# Altium schematic sheet USB-UART (FTDI FT230XS).SchDoc
size A4; Revision: 0; SheetNumber: 1
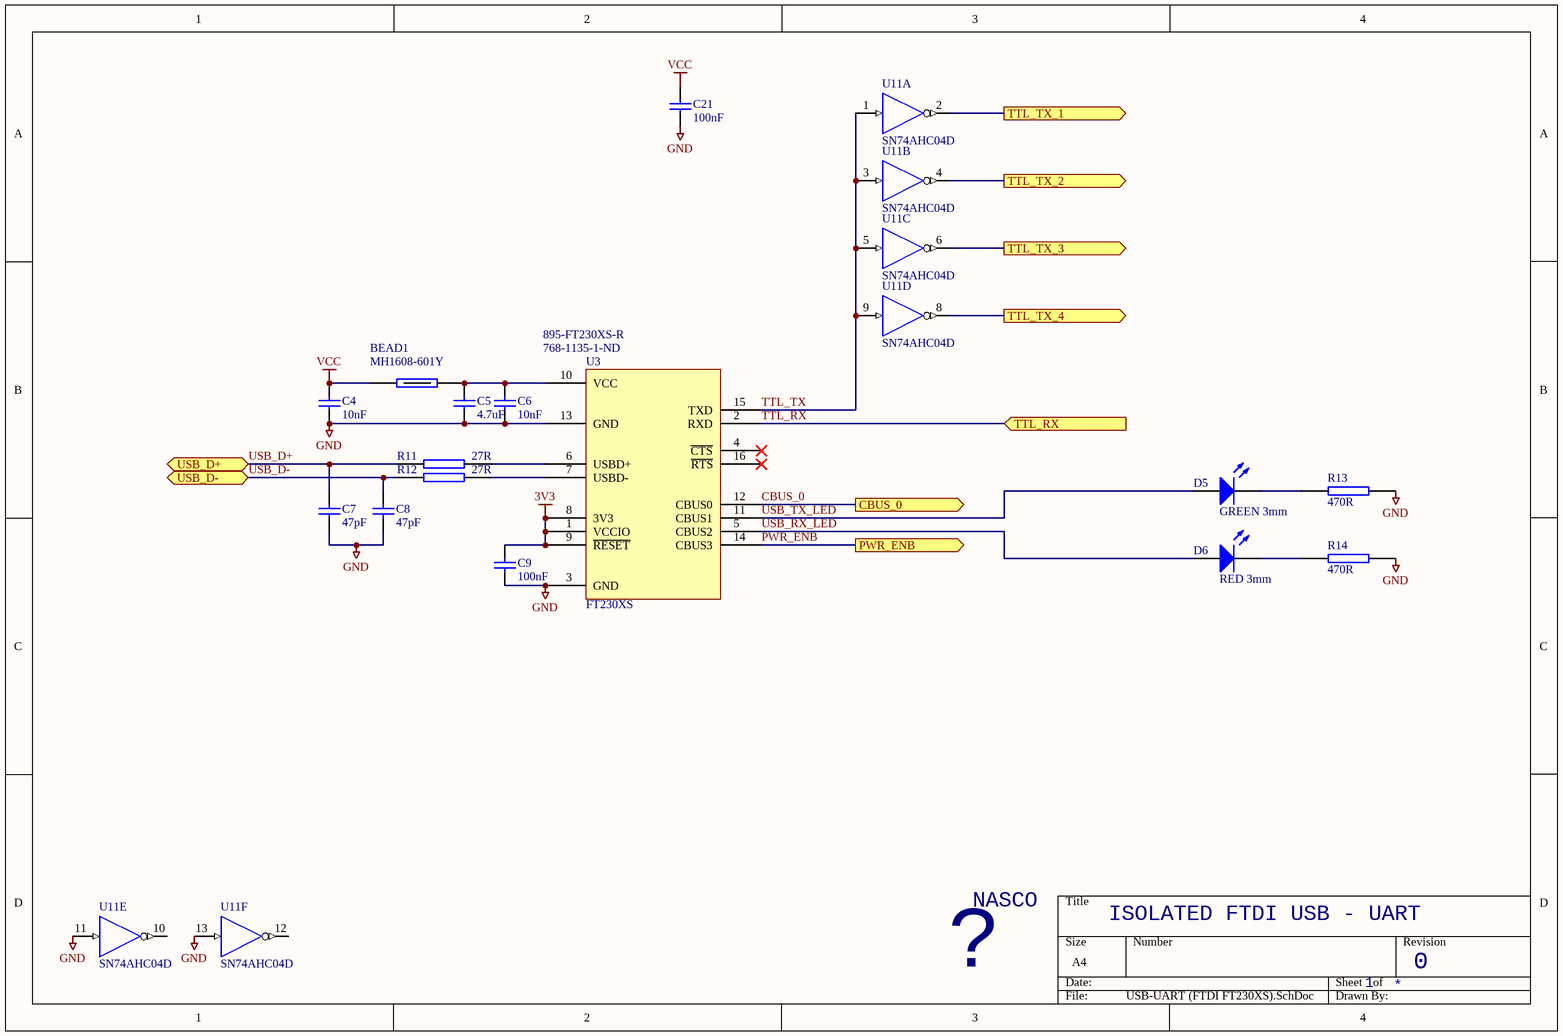
[diagram p0: USB-UART (FTDI FT230XS).SchDoc]

## Parts
BEAD1  MH1608-601Y  [RES (3D) - 0603]
C4  10nF  [CAP (3D) - 0603]
C5  4.7uF  [CAP ELECTRO SIZE-C]
C6  10nF  [CAP (3D) - 0603]
C7  47pF  [CAP (3D) - 0603]
C8  47pF  [CAP (3D) - 0603]
C9  100nF  [CAP (3D) - 0603]
C21  100nF  [CAP (3D) - 0603]
D5  GREEN 3mm  [LED(3D) 3MM RIGHT ANGLE GREEN]
D6  RED 3mm  [LED(3D) 3MM RIGHT ANGLE RED]
R11  27R  [RES (3D) - 0603]
R12  27R  [RES (3D) - 0603]
R13  470R  [RES (3D) - 0603]
R14  470R  [RES (3D) - 0603]
U3  FT230XS  Supplier Part Number 1: 768-1135-1-ND  Supplier Part Number 2: 895-FT230XS-R  [SSOP16_L]
U11  SN74AHC04D  [SOIC-14]  (parts A,B,C,D,E,F of 6)

## Ports
CBUS_0 (out), PWR_ENB (out), TTL_RX, TTL_TX_1 (out), TTL_TX_2 (out), TTL_TX_3 (out), TTL_TX_4 (out), USB_D+ (bidir), USB_D- (bidir)

## Nets
3V3: C9.2 U3.1(VCCIO) U3.8(3V3) U3.9(~{RESET})
GND: C4.1 C5.2 C6.1 C7.1 C8.1 C9.1 C21.1 R13.2 R14.2 U3.3(GND) U3.13(GND) U11.7(GND) U11.11(A) U11.13(A)
VCC: BEAD1.1 C4.2 C21.2 U11.14(VCC)
CBUS_0: U3.12(CBUS0) ; port CBUS_0
PWR_ENB: U3.14(CBUS3) ; port PWR_ENB
TTL_RX: U3.2(RXD) ; port TTL_RX
TTL_TX: U3.15(TXD) U11.1(A) U11.3(A) U11.5(A) U11.9(A)
TTL_TX_1: U11.2(Y) ; port TTL_TX_1
TTL_TX_2: U11.4(Y) ; port TTL_TX_2
TTL_TX_3: U11.6(Y) ; port TTL_TX_3
TTL_TX_4: U11.8(Y) ; port TTL_TX_4
USB_D+: C7.2 R11.1 ; port USB_D+
USB_D-: C8.2 R12.1 ; port USB_D-
USB_RX_LED: D6.1(A) U3.5(CBUS2)
USB_TX_LED: D5.1(A) U3.11(CBUS1)
NetBEAD1_2: BEAD1.2 C5.1 C6.2 U3.10(VCC)
NetD5_2: D5.2(K) R13.1
NetD6_2: D6.2(K) R14.1
NetR11_2: R11.2 U3.6(USBD+)
NetR12_2: R12.2 U3.7(USBD-)

Not connected (* = marked no-connect by the designer): U3 4(~{CTS})* 16(~{RTS})*; U11 10(Y) 12(Y)

## Notes on the sheet
- NASCO
- ISOLATED FTDI USB - UART
- ?

## Library data of the parts
BEAD1 = FERRITE BEAD 0603: FERRITE BEAD 0603 BOURNS MH1608-601Y; Value: MH1608-601Y
C4-C9 C21 = Cap: Capacitor
  C4 C6: Value: 10nF
  C5: Value: 4.7uF; Supplier 1: Digi-Key; Supplier 2: Mouser; Supplier Part Number 2: 598-AVE475M50C12T-F
  C7 C8: Value: 47pF
  C9 C21: Value: 100nF; Supplier 1: Mouser; Supplier 2: Digi-Key; Supplier Part Number 1: 603-C0603ZRY5V9BB104; Supplier Part Number 2: 311-1343-2-ND
D5 D6 = LED 3mm RED: 3mm RED LED; Manufacturer: Kingbright; Manufacturer Part No.: WP132XIT; Mouser Part no.: 604-WP132XIT; Farnell Part no.: 1003393; Web link: http://au.mouser.com/Search/Refine.aspx?Keyword=604-WP132XIT
  D5: Value: GREEN 3mm
  D6: Value: RED 3mm
R11 R12 = RES SMD 0603 100R: RESISTOR SMD 0603; Value: 27R
R13 R14 = RES SMD 0603 1k: RESISTOR SMD 0603 1k; value: 470R
U3 = FTDI FT230XS: FTDI FT230XS USB - UART; Supplier 1: Digi-Key; Supplier 2: Mouser
U11 = SN74AHC04D: Hex Inverter; Published: 8-Jun-2000; LatestRevisionDate: 13-Apr-2006; LatestRevisionNote: IPC-7351 Footprint Added.; DatasheetVersion: Jun-1998; PackageVersion: Jan-1998; PackageReference: D014; Publisher: Altium Limited; PackageDescription: 14-Pin Small Outline Integrated Circuit 1.27 mm Pitch; Code_IPC: SOIC127P600-14; ComponentLink1Description: Manufacturer Link; ComponentLink1URL: http://www.ti.com/; ComponentLink2Description: Datasheet; ComponentLink2URL: http://www-s.ti.com/sc/ds/sn74ahc04.pdf; ComponentLink3Description: Packaging Specification; ComponentLink3URL: http://focus.ti.com/lit/ml/mpds177/mpds177.pdf